# Altium schematic sheet Sheet1.SCHDOC
size 420 x 297 mm; SheetNumber: 1; SheetTotal: 1; DocumentName: Sheet1.SCHDOC
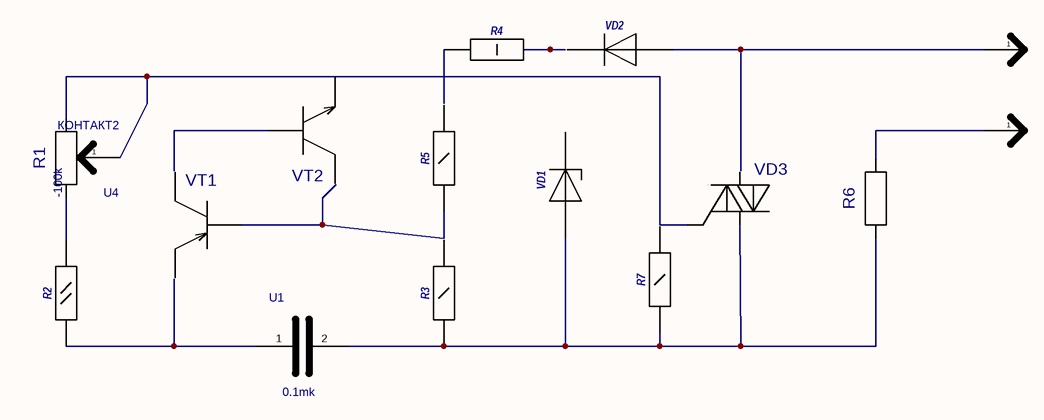
[diagram p0: Sheet1.SCHDOC]

## Parts
R1  value -100k  [R1W]  (hidden comment: R1W)
R2  МЛТ(0.125)  [МЛТ(0.125)]  (value not drawn)
R3  МЛТ(0.25)  [МЛТ(0.25)]  (value not drawn)
R4  МЛТ(1)  [МЛТ(1)]  (value not drawn)
R5  МЛТ(0.25)  [МЛТ(0.25)]  (value not drawn)
R6  R1W  [R1W]  (value not drawn)
R7  МЛТ(0.25)  [МЛТ(0.25)]  (value not drawn)
U  КОНТАКТ2  (value not drawn)
U1  value 0.1mk  (hidden comment: K50-29)
U2  КОНТАКТ2  (value not drawn)
U4  КОНТАКТ2
VD1  KC139A  [KC139]  (value not drawn)
VD2  КД522Б  [КД522]  (value not drawn)
VD3  KU605  [KT28-1]  (value not drawn)
VT1  KT361  [KT13]  (value not drawn)
VT2  KT315  [KT13]  (value not drawn)

## Nets
NetR1_1: R1.1(I/OA) R2.2
NetR1_2: R1.2(I/OB) U4.1 VD3.2(I/OB)
NetR2_1: R2.1 U1.1
NetR3_1: R3.1 R6.1(I/OA) R7.1 U1.2 VD1.1 VD3.3(IN)
NetR5_1: R5.1 VT1.2(B)
NetR6_2: R6.2(I/OB) U.1
NetU2_1: U2.1 VD2.1

Not connected (* = marked no-connect by the designer): R3 2; R4 1 2; R5 2; R7 2; VD1 2; VD2 2; VD3 1(I/OA); VT1 1(E) 3(K); VT2 1(E) 2(B) 3(K)

## Library data of the parts
R1 = R1W: PDIF_TY: 11107
R2 = МЛТ(0.125): Value: 4.7k
R6 = R1W_VARIANT_1: PDIF_TY: 11107; Value: *
U2 U4 = КОНТАКТ2_VARIANT_1: Value: *
VD3 = KU605: Value: *
VT1 = KT361: Value: *
VT2 = KT315: Value: *